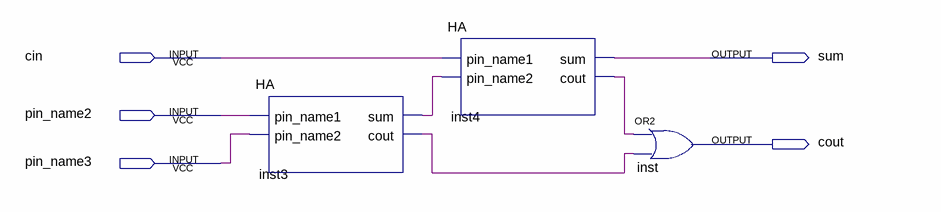
[diagram p0: schematic sheet]
// Quartus schematic FA.bdf as structural Verilog: 3 symbols, 5 pins
module FA (
  input  cin,
  input  pin_name2,
  input  pin_name3,
  output sum,
  output cout
);

  wire inst3_cout, inst3_sum, inst4_cout;

  HA inst3 (.pin_name1(pin_name2), .pin_name2(pin_name3), .sum(inst3_sum), .cout(inst3_cout));
  HA inst4 (.pin_name1(cin), .pin_name2(inst3_sum), .sum(sum), .cout(inst4_cout));
  or inst (cout, inst4_cout, inst3_cout);
endmodule
